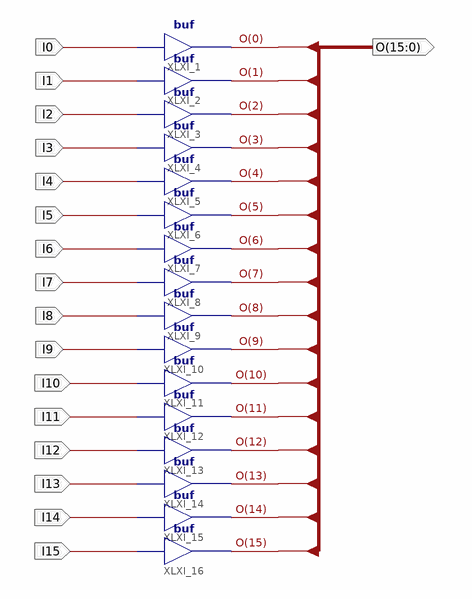
[diagram p0: schematic sheet 1]
// Xilinx ISE schematic wtb16.sch (spartan6) as structural Verilog: 16 symbols, 17 ports
module wtb16 (
  input  I0,
  input  I1,
  input  I2,
  input  I3,
  input  I4,
  input  I5,
  input  I6,
  input  I7,
  input  I8,
  input  I9,
  input  I10,
  input  I11,
  input  I12,
  input  I13,
  input  I14,
  input  I15,
  output [15:0] O
);

  buf XLXI_1 (O[0], I0);
  buf XLXI_2 (O[1], I1);
  buf XLXI_3 (O[2], I2);
  buf XLXI_4 (O[3], I3);
  buf XLXI_5 (O[4], I4);
  buf XLXI_6 (O[5], I5);
  buf XLXI_7 (O[6], I6);
  buf XLXI_8 (O[7], I7);
  buf XLXI_9 (O[8], I8);
  buf XLXI_10 (O[9], I9);
  buf XLXI_11 (O[10], I10);
  buf XLXI_12 (O[11], I11);
  buf XLXI_13 (O[12], I12);
  buf XLXI_14 (O[13], I13);
  buf XLXI_15 (O[14], I14);
  buf XLXI_16 (O[15], I15);
endmodule
